# Altium schematic sheet Channel.SchDoc
size A; SheetNumber: 3; SheetTotal: 12
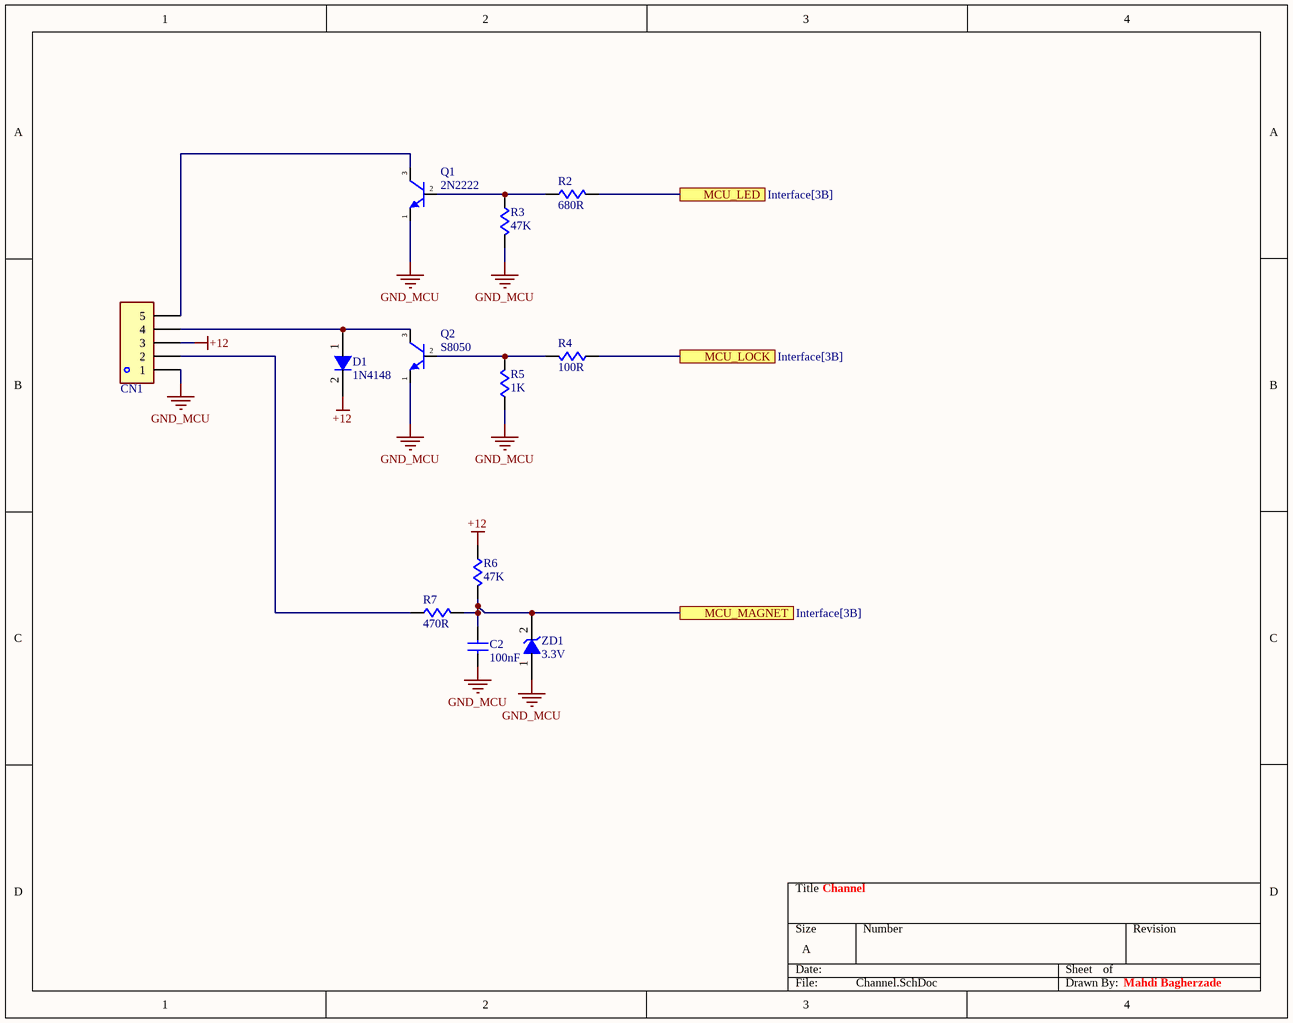
[diagram p0: Channel.SchDoc]

## Parts
C2  value 100nF  [C-0805]  (hidden comment: CAP Cer 100nF-50V-X7R-SMD)
CN1  Connector XH-Straight-THD-2.54mm  [XH-5]  (value not drawn)
D1  Code: 1N4148  [SOD80]  (hidden comment: Diode 1N4148-SMD)
Q1  value 2N2222  [SOT23-213]  (hidden comment: TR 2N2222-SMD)
Q2  value S8050  [SOT23-213]  (hidden comment: TR S8050-SMD)
R2  value 680R  [R-0805]  (hidden comment: RES 680R-5%-1/8W-SMD)
R3  value 47K  [R-0805]  (hidden comment: RES 47K-5%-1/8W-SMD)
R4  value 100R  [R-0805]  (hidden comment: RES 100R-5%-1/8W-SMD)
R5  value 1K  [R-0805]  (hidden comment: RES 1K-5%-1/8W-SMD)
R6  value 47K  [R-0805]  (hidden comment: RES 47K-5%-1/8W-SMD)
R7  value 470R  [R-0805]  (hidden comment: RES 470R-5%-1/8W-SMD)
ZD1  Voltage: 3.3V  [SOD80]  (hidden comment: Zener -3.3V-SMD)

## Ports
MCU_LED (see Interface[3B]), MCU_LOCK (see Interface[3B]), MCU_MAGNET (see Interface[3B])

## Nets
+12: CN1.3 D1.2(C) R6.1
GND_MCU: C2.2 CN1.1 Q1.1(E) Q2.1(E) R3.2 R5.1 ZD1.1(A)
MCU_LED: R2.2 ; port MCU_LED
MCU_LOCK: R4.1 ; port MCU_LOCK
MCU_MAGNET: C2.1 R6.2 R7.2 ZD1.2(C) ; port MCU_MAGNET
NetCN1_2: CN1.2 R7.1
NetCN1_4: CN1.4 D1.1(A) Q2.3(C)
NetCN1_5: CN1.5 Q1.3(C)
NetQ1_2: Q1.2(B) R2.1 R3.1
NetQ2_2: Q2.2(B) R4.2 R5.2

## Notes on the sheet
- Channel
- Mahdi Bagherzade

## Library data of the parts
C2 = CAP-CER: CAPACITOR; Phone Number: 0915 8700 314; Voltage: 50V; Tolerance: X7R; Type: SMD; Publisher: Mahdi Bagherzadeh; ComponentLink1Description: Linkedin; ComponentLink1URL: https://ir.linkedin.com/in/mahdi-bagherzade; Published Date: 9-15-2024
CN1 = CN-5pin: CONNECTOR; Phone Number: 0915 8700 314; Value: XH; Publisher: Mahdi Bagherzadeh; ComponentLink1Description: Linkedin; ComponentLink1URL: https://ir.linkedin.com/in/mahdi-bagherzade; Published Date: 9-15-2024; Type: Straight-THD; Size: 2.54mm
D1 = DIODE: Phone Number: 0915 8700 314; Type: SMD; Publisher: Mahdi Bagherzadeh; ComponentLink1Description: Linkedin; ComponentLink1URL: https://ir.linkedin.com/in/mahdi-bagherzade; Published Date: 9-15-2024
Q1 = 2N2222: TRANSISTOR; Phone Number: 0915 8700 314; Type: SMD; Code: 1P; Publisher: Mahdi Bagherzadeh; ComponentLink1Description: Linkedin; ComponentLink1URL: https://ir.linkedin.com/in/mahdi-bagherzade; Published Date: 9-15-2024
Q2 = S8050: TRANSISTOR; Phone Number: 0915 8700 314; Code: J3Y; Type: SMD; Publisher: Mahdi Bagherzadeh; ComponentLink1Description: Linkedin; ComponentLink1URL: https://ir.linkedin.com/in/mahdi-bagherzade; Published Date: 9-15-2024
R2-R7 = RES: RESISTOR; Phone Number: 0915 8700 314; Tolerance: 5%; Power: 1/8W; Publisher: Mahdi Bagherzadeh; ComponentLink1Description: Linkedin; ComponentLink1URL: https://ir.linkedin.com/in/mahdi-bagherzade; Published Date: 9-15-2024; Type: SMD
ZD1 = DIODE-ZENER: DIODE; Phone Number: 0915 8700 314; Power: Minimelf; Publisher: Mahdi Bagherzadeh; ComponentLink1Description: Linkedin; ComponentLink1URL: https://ir.linkedin.com/in/mahdi-bagherzade; Published Date: 9-15-2024; Type: SMD